# Altium schematic sheet ProPrj_HTXStudio_OneHanded_Keyboard.SchDoc
size 594 x 420 mm
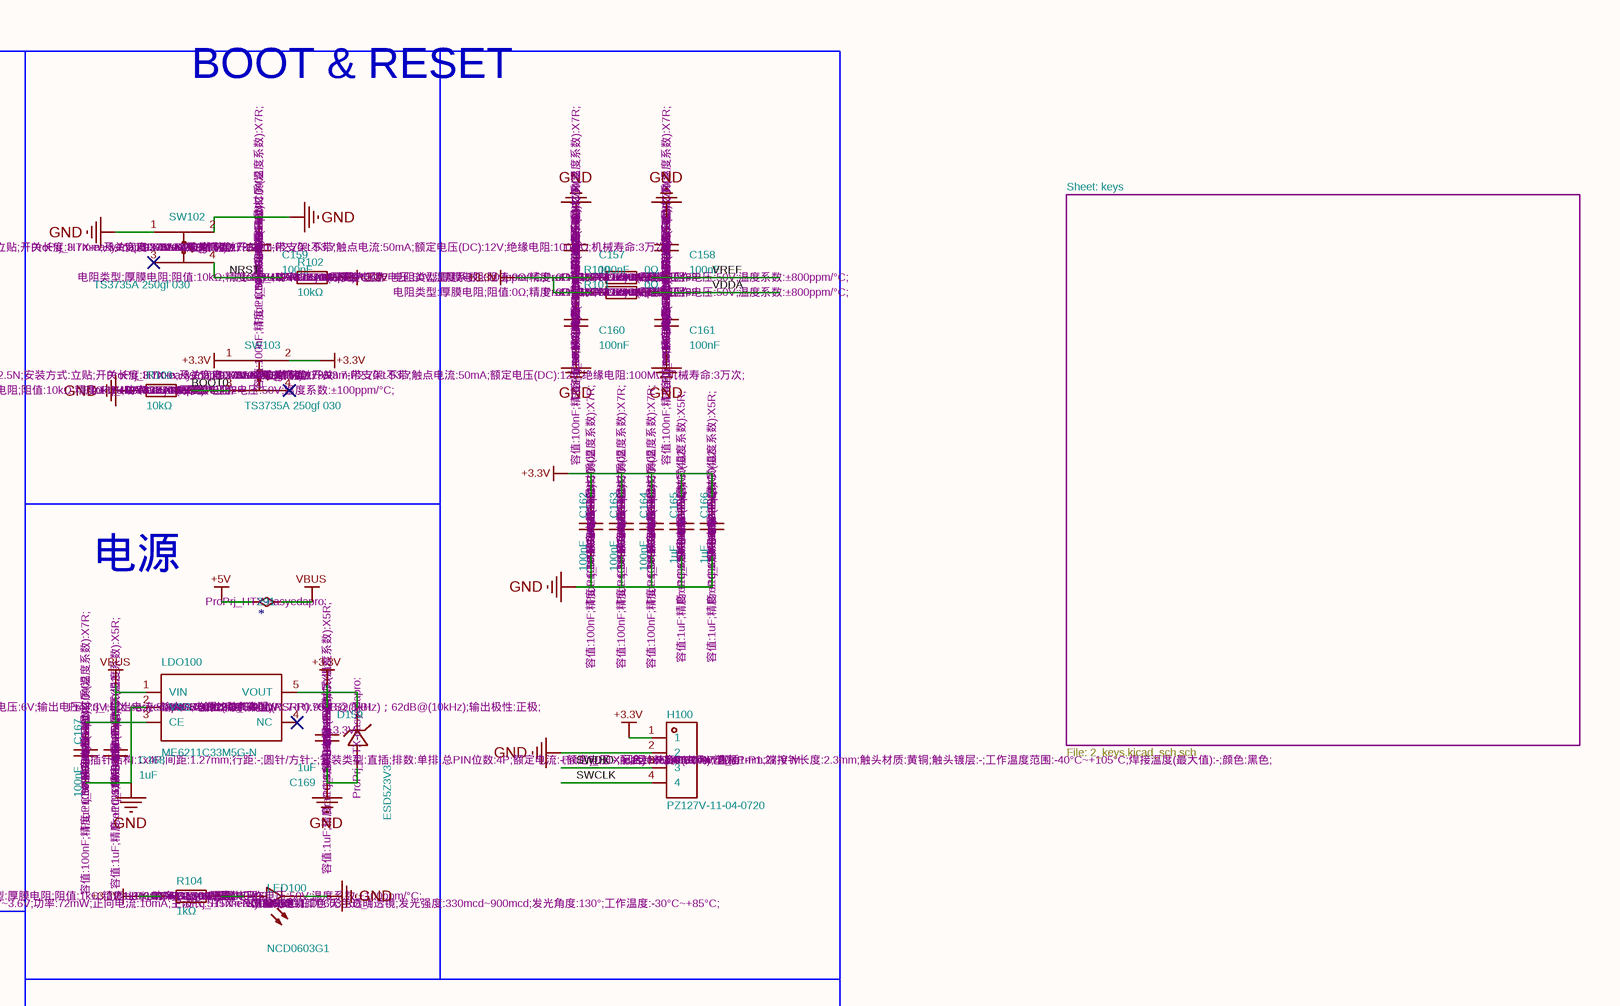
[diagram p0: ProPrj_HTXStudio_OneHanded_Keyboard.SchDoc, top right]
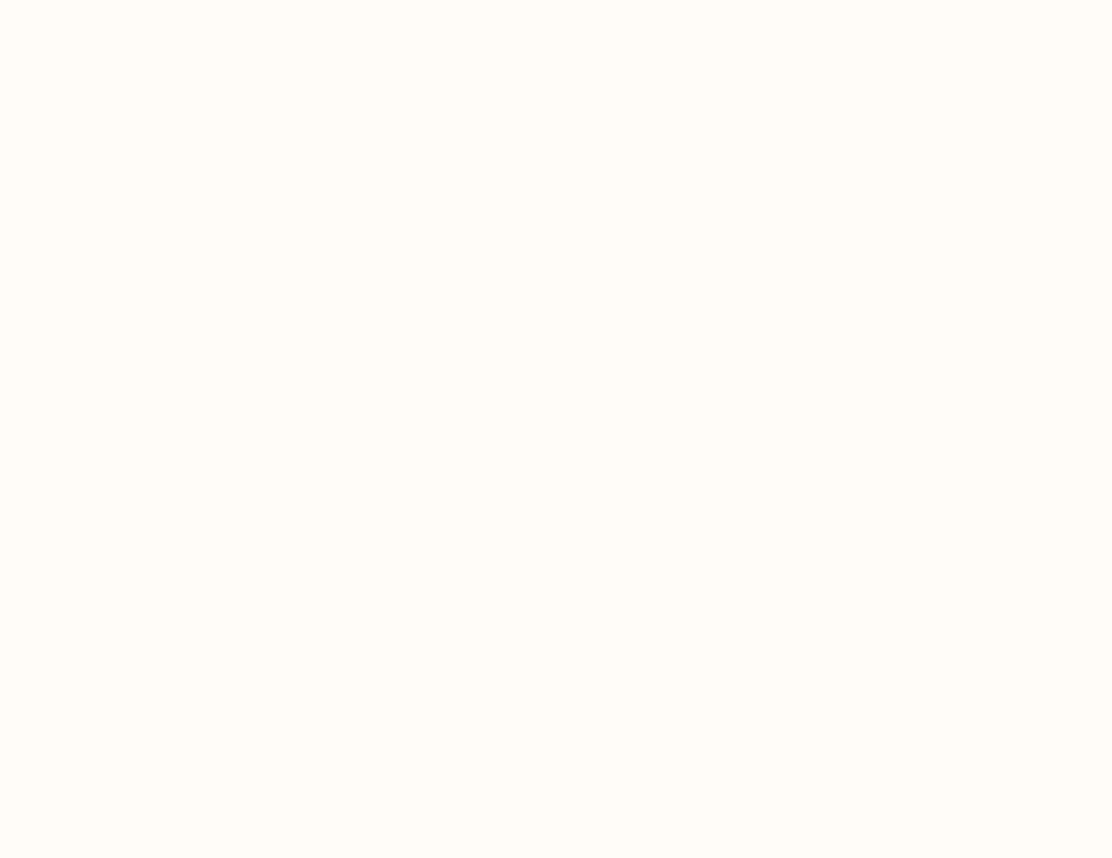
[diagram p1: ProPrj_HTXStudio_OneHanded_Keyboard.SchDoc, bottom left]
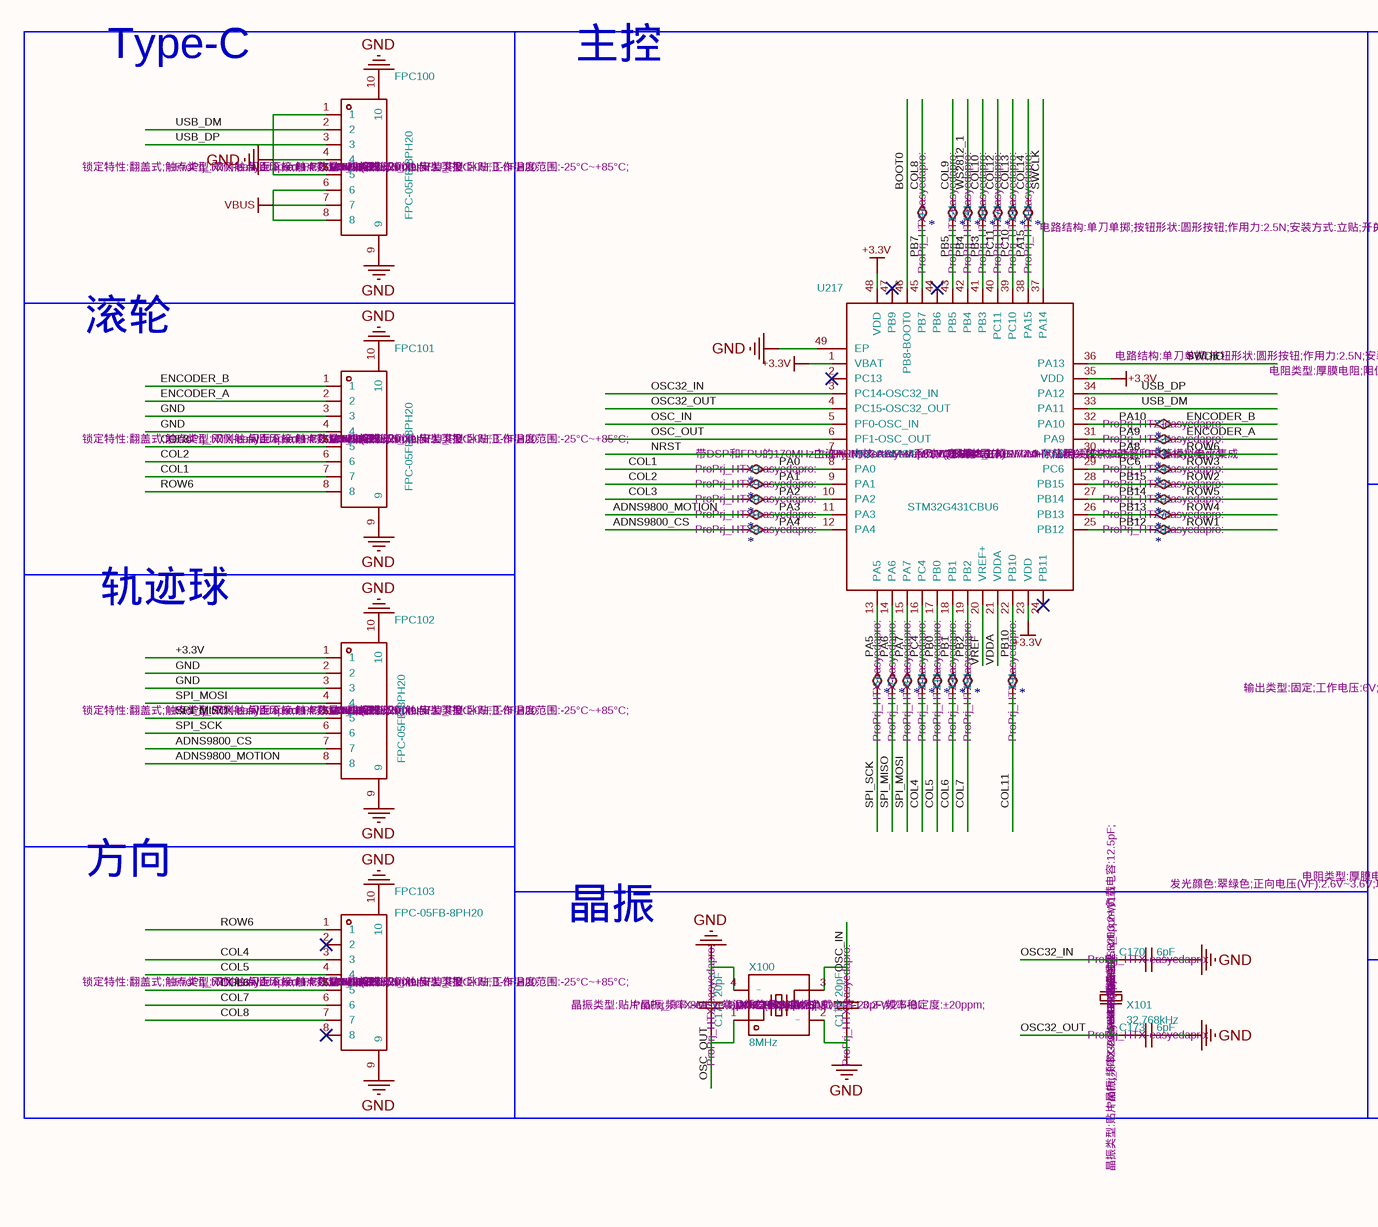
[diagram p2: ProPrj_HTXStudio_OneHanded_Keyboard.SchDoc, bottom middle]
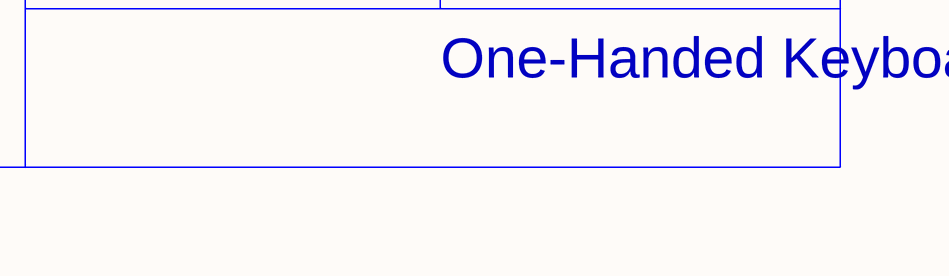
[diagram p3: ProPrj_HTXStudio_OneHanded_Keyboard.SchDoc, bottom right]

## Parts
11  *  Footprint: ProPrj_HTX-easyedapro:
21  *  Footprint: ProPrj_HTX-easyedapro:
31  *  Footprint: ProPrj_HTX-easyedapro:
41  *  Footprint: ProPrj_HTX-easyedapro:
51  *  Footprint: ProPrj_HTX-easyedapro:
61  *  Footprint: ProPrj_HTX-easyedapro:
71  *  Footprint: ProPrj_HTX-easyedapro:
81  *  Footprint: ProPrj_HTX-easyedapro:
91  *  Footprint: ProPrj_HTX-easyedapro:
101  *  Footprint: ProPrj_HTX-easyedapro:
111  *  Footprint: ProPrj_HTX-easyedapro:
121  *  Footprint: ProPrj_HTX-easyedapro:
131  *  Footprint: ProPrj_HTX-easyedapro:
141  *  Footprint: ProPrj_HTX-easyedapro:
151  *  Footprint: ProPrj_HTX-easyedapro:
161  *  Footprint: ProPrj_HTX-easyedapro:
171  *  Footprint: ProPrj_HTX-easyedapro:
181  *  Footprint: ProPrj_HTX-easyedapro:
191  *  Footprint: ProPrj_HTX-easyedapro:
201  *  Footprint: ProPrj_HTX-easyedapro:
211  *  Footprint: ProPrj_HTX-easyedapro:
221  *  Footprint: ProPrj_HTX-easyedapro:
231  *  Footprint: ProPrj_HTX-easyedapro:
241  *  Footprint: ProPrj_HTX-easyedapro:
251  *  Footprint: ProPrj_HTX-easyedapro:
261  *  Footprint: ProPrj_HTX-easyedapro:
271  *  Footprint: ProPrj_HTX-easyedapro:
281  *  Footprint: ProPrj_HTX-easyedapro:
291  *  Footprint: ProPrj_HTX-easyedapro:
C157  Description: 容值:100nF;精度:±10%;额定电压:50V;材质(温度系数):X7R;  Manufacturer: SAMSUNG(三星)  Supplier Part: C307331  Supplier: LCSC  LCSC Part Name: 100nF ±10% 50V  Footprint: ProPrj_HTX-easyedapro:C0402  [C0402]  (hidden comment: 100nF)
C158  Description: 容值:100nF;精度:±10%;额定电压:50V;材质(温度系数):X7R;  Manufacturer: SAMSUNG(三星)  Supplier Part: C307331  Supplier: LCSC  LCSC Part Name: 100nF ±10% 50V  Footprint: ProPrj_HTX-easyedapro:C0402  [C0402]  (hidden comment: 100nF)
C159  Description: 容值:100nF;精度:±10%;额定电压:50V;材质(温度系数):X7R;  Manufacturer: SAMSUNG(三星)  Supplier Part: C307331  Supplier: LCSC  LCSC Part Name: 100nF ±10% 50V  Footprint: ProPrj_HTX-easyedapro:C0402  [C0402]  (hidden comment: 100nF)
C160  Description: 容值:100nF;精度:±10%;额定电压:50V;材质(温度系数):X7R;  Manufacturer: SAMSUNG(三星)  Supplier Part: C307331  Supplier: LCSC  LCSC Part Name: 100nF ±10% 50V  Footprint: ProPrj_HTX-easyedapro:C0402  [C0402]  (hidden comment: 100nF)
C161  Description: 容值:100nF;精度:±10%;额定电压:50V;材质(温度系数):X7R;  Manufacturer: SAMSUNG(三星)  Supplier Part: C307331  Supplier: LCSC  LCSC Part Name: 100nF ±10% 50V  Footprint: ProPrj_HTX-easyedapro:C0402  [C0402]  (hidden comment: 100nF)
C162  Description: 容值:100nF;精度:±10%;额定电压:50V;材质(温度系数):X7R;  Manufacturer: SAMSUNG(三星)  Supplier Part: C307331  Supplier: LCSC  LCSC Part Name: 100nF ±10% 50V  Footprint: ProPrj_HTX-easyedapro:C0402  [C0402]  (hidden comment: 100nF)
C163  Description: 容值:100nF;精度:±10%;额定电压:50V;材质(温度系数):X7R;  Manufacturer: SAMSUNG(三星)  Supplier Part: C307331  Supplier: LCSC  LCSC Part Name: 100nF ±10% 50V  Footprint: ProPrj_HTX-easyedapro:C0402  [C0402]  (hidden comment: 100nF)
C164  Description: 容值:100nF;精度:±10%;额定电压:50V;材质(温度系数):X7R;  Manufacturer: SAMSUNG(三星)  Supplier Part: C307331  Supplier: LCSC  LCSC Part Name: 100nF ±10% 50V  Footprint: ProPrj_HTX-easyedapro:C0402  [C0402]  (hidden comment: 100nF)
C165  Description: 容值:1uF;精度:±10%;额定电压:25V;材质(温度系数):X5R;  Manufacturer: SAMSUNG(三星)  Supplier Part: C52923  Supplier: LCSC  LCSC Part Name: 1uF ±10% 25V  Footprint: ProPrj_HTX-easyedapro:C0402  [C0402]  (hidden comment: 1uF)
C166  Description: 容值:1uF;精度:±10%;额定电压:25V;材质(温度系数):X5R;  Manufacturer: SAMSUNG(三星)  Supplier Part: C52923  Supplier: LCSC  LCSC Part Name: 1uF ±10% 25V  Footprint: ProPrj_HTX-easyedapro:C0402  [C0402]  (hidden comment: 1uF)
C167  Description: 容值:100nF;精度:±10%;额定电压:50V;材质(温度系数):X7R;  Manufacturer: SAMSUNG(三星)  Supplier Part: C307331  Supplier: LCSC  LCSC Part Name: 100nF ±10% 50V  Footprint: ProPrj_HTX-easyedapro:C0402  [C0402]  (hidden comment: 100nF)
C168  Description: 容值:1uF;精度:±10%;额定电压:25V;材质(温度系数):X5R;  Manufacturer: SAMSUNG(三星)  Supplier Part: C52923  Supplier: LCSC  LCSC Part Name: 1uF ±10% 25V  Footprint: ProPrj_HTX-easyedapro:C0402  [C0402]  (hidden comment: 1uF)
C169  Description: 容值:1uF;精度:±10%;额定电压:25V;材质(温度系数):X5R;  Manufacturer: SAMSUNG(三星)  Supplier Part: C52923  Supplier: LCSC  LCSC Part Name: 1uF ±10% 25V  Footprint: ProPrj_HTX-easyedapro:C0402  [C0402]  (hidden comment: 1uF)
C170  Footprint: ProPrj_HTX-easyedapro:  (hidden comment: 6pF)
C171  Footprint: ProPrj_HTX-easyedapro:  (hidden comment: 20pF)
C172  Footprint: ProPrj_HTX-easyedapro:  (hidden comment: 20pF)
C173  Footprint: ProPrj_HTX-easyedapro:  (hidden comment: 6pF)
D159  Description: +3.3V  Footprint: ProPrj_HTX-easyedapro:  (hidden comment: ESD5Z3V3)
FPC100  Description: 锁定特性:翻盖式;触点类型:双侧触点/上下接;触点数量:8P;间距:0.5mm;安装类型:卧贴;工作温度范围:-25°C~+85°C;  Manufacturer: XUNPU(讯普)  Supplier Part: C2856828  Supplier: LCSC  LCSC Part Name: 间距:0.5mm P数:8P 翻盖式 双侧触点/上下接  Footprint: ProPrj_HTX-easyedapro:FPC-SMD_8P-P0.50_XUNPU_FPC-05FB-8PH20  [FPC-SMD_8P-P0.50_XUNPU_FPC-05FB-8PH20]  (hidden comment: FPC-05FB-8PH20)
FPC101  Description: 锁定特性:翻盖式;触点类型:双侧触点/上下接;触点数量:8P;间距:0.5mm;安装类型:卧贴;工作温度范围:-25°C~+85°C;  Manufacturer: XUNPU(讯普)  Supplier Part: C2856828  Supplier: LCSC  LCSC Part Name: 间距:0.5mm P数:8P 翻盖式 双侧触点/上下接  Footprint: ProPrj_HTX-easyedapro:FPC-SMD_8P-P0.50_XUNPU_FPC-05FB-8PH20  [FPC-SMD_8P-P0.50_XUNPU_FPC-05FB-8PH20]  (hidden comment: FPC-05FB-8PH20)
FPC102  Description: 锁定特性:翻盖式;触点类型:双侧触点/上下接;触点数量:8P;间距:0.5mm;安装类型:卧贴;工作温度范围:-25°C~+85°C;  Manufacturer: XUNPU(讯普)  Supplier Part: C2856828  Supplier: LCSC  LCSC Part Name: 间距:0.5mm P数:8P 翻盖式 双侧触点/上下接  Footprint: ProPrj_HTX-easyedapro:FPC-SMD_8P-P0.50_XUNPU_FPC-05FB-8PH20  [FPC-SMD_8P-P0.50_XUNPU_FPC-05FB-8PH20]  (hidden comment: FPC-05FB-8PH20)
FPC103  Description: 锁定特性:翻盖式;触点类型:双侧触点/上下接;触点数量:8P;间距:0.5mm;安装类型:卧贴;工作温度范围:-25°C~+85°C;  Manufacturer: XUNPU(讯普)  Supplier Part: C2856828  Supplier: LCSC  LCSC Part Name: 间距:0.5mm P数:8P 翻盖式 双侧触点/上下接  Footprint: ProPrj_HTX-easyedapro:FPC-SMD_8P-P0.50_XUNPU_FPC-05FB-8PH20  [FPC-SMD_8P-P0.50_XUNPU_FPC-05FB-8PH20]  (hidden comment: FPC-05FB-8PH20)
H100  Description: 插针结构:1x4P;间距:1.27mm;行距:-;圆针/方针:-;安装类型:直插;排数:单排;总PIN位数:4P;额定电流:-;额定电压:-;配合针长度:3.9mm;塑高:1mm;端接针长度:2.3mm;触头材质:黄铜;触头镀层:-;工作温度范围:-40°C~+105°C;焊接温度(最大值):-;颜色:黑色;  Manufacturer: XFCN(兴飞)  Supplier Part: C541879  Supplier: LCSC  LCSC Part Name: 间距:1.27mm 1x4P 直插  Footprint: ProPrj_HTX-easyedapro:HDR-TH_4P-P1.27-V-M  [HDR-TH_4P-P1.27-V-M]  (hidden comment: PZ127V-11-04-0720)
LDO100  Description: 输出类型:固定;工作电压:6V;输出电压:3.3V;输出电流:500mA;电源纹波抑制比(PSRR):70dB@(1kHz)；62dB@(10kHz);输出极性:正极;  Manufacturer: MICRONE(南京微盟)  Supplier Part: C82942  Supplier: LCSC  LCSC Part Name: 输入6V 输出3.3V 500mA  Footprint: ProPrj_HTX-easyedapro:SOT-23-5_L3.0-W1.7-P0.95-LS2.8-BL  [SOT-23-5_L3.0-W1.7-P0.95-LS2.8-BL]  (hidden comment: ME6211C33M5G-N)
LED100  Description: 发光颜色:翠绿色;正向电压(VF):2.6V~3.6V;功率:72mW;正向电流:10mA;主波长:515nm~530nm;透镜颜色:无色透明透镜;发光强度:330mcd~900mcd;发光角度:130°;工作温度:-30°C~+85°C;  Manufacturer: 国星光电  Supplier Part: C84267  Supplier: LCSC  Footprint: ProPrj_HTX-easyedapro:LED0603-RD_1  [LED0603-RD_1]  (hidden comment: NCD0603G1)
R100  Description: 电阻类型:厚膜电阻;阻值:0Ω;精度:±1%;功率:62.5mW;最大工作电压:50V;温度系数:±800ppm/°C;  Manufacturer: UNI-ROYAL(厚声)  Supplier Part: C17168  Supplier: LCSC  LCSC Part Name: 0Ω ±1% 62.5mW 厚膜电阻  Footprint: ProPrj_HTX-easyedapro:R0402  [R0402]  (hidden comment: 0Ω)
R101  Description: 电阻类型:厚膜电阻;阻值:0Ω;精度:±1%;功率:62.5mW;最大工作电压:50V;温度系数:±800ppm/°C;  Manufacturer: UNI-ROYAL(厚声)  Supplier Part: C17168  Supplier: LCSC  LCSC Part Name: 0Ω ±1% 62.5mW 厚膜电阻  Footprint: ProPrj_HTX-easyedapro:R0402  [R0402]  (hidden comment: 0Ω)
R102  Description: 电阻类型:厚膜电阻;阻值:10kΩ;精度:±1%;功率:62.5mW;最大工作电压:50V;温度系数:±100ppm/°C;  Manufacturer: UNI-ROYAL(厚声)  Supplier Part: C25744  Supplier: LCSC  LCSC Part Name: 10kΩ ±1% 62.5mW 厚膜电阻  Footprint: ProPrj_HTX-easyedapro:R0402  [R0402]  (hidden comment: 10kΩ)
R103  Description: 电阻类型:厚膜电阻;阻值:10kΩ;精度:±1%;功率:62.5mW;最大工作电压:50V;温度系数:±100ppm/°C;  Manufacturer: UNI-ROYAL(厚声)  Supplier Part: C25744  Supplier: LCSC  LCSC Part Name: 10kΩ ±1% 62.5mW 厚膜电阻  Footprint: ProPrj_HTX-easyedapro:R0402  [R0402]  (hidden comment: 10kΩ)
R104  Description: 电阻类型:厚膜电阻;阻值:1kΩ;精度:±1%;功率:62.5mW;最大工作电压:50V;温度系数:±100ppm/°C;  Manufacturer: UNI-ROYAL(厚声)  Supplier Part: C11702  Supplier: LCSC  LCSC Part Name: 1kΩ ±1% 62.5mW 厚膜电阻  Footprint: ProPrj_HTX-easyedapro:R0402  [R0402]  (hidden comment: 1kΩ)
SW102  Description: 电路结构:单刀单掷;按钮形状:圆形按钮;作用力:2.5N;安装方式:立贴;开关长度:3.7mm;开关宽度:3.7mm;开关高度:0.35mm;带支架:不带;触点电流:50mA;额定电压(DC):12V;绝缘电阻:100MΩ;机械寿命:3万次;  Manufacturer: SHOU HAN(首韩)  Supplier Part: C2906282  Supplier: LCSC  LCSC Part Name: 3.7*3.7*0.35mm 立贴 轻触开关  Footprint: ProPrj_HTX-easyedapro:SW-SMD_4P-L3.7-W3.7-P2.70-LS3.7  [SW-SMD_4P-L3.7-W3.7-P2.70-LS3.7]  (hidden comment: TS3735A 250gf 030)
SW103  Description: 电路结构:单刀单掷;按钮形状:圆形按钮;作用力:2.5N;安装方式:立贴;开关长度:3.7mm;开关宽度:3.7mm;开关高度:0.35mm;带支架:不带;触点电流:50mA;额定电压(DC):12V;绝缘电阻:100MΩ;机械寿命:3万次;  Manufacturer: SHOU HAN(首韩)  Supplier Part: C2906282  Supplier: LCSC  LCSC Part Name: 3.7*3.7*0.35mm 立贴 轻触开关  Footprint: ProPrj_HTX-easyedapro:SW-SMD_4P-L3.7-W3.7-P2.70-LS3.7  [SW-SMD_4P-L3.7-W3.7-P2.70-LS3.7]  (hidden comment: TS3735A 250gf 030)
U217  Description: CPU内核:ARM-M系列;CPU最大主频:170MHz;应用领域:-;  Manufacturer: ST(意法半导体)  Supplier Part: C529356  Supplier: LCSC  LCSC Part Name: 带DSP和FPU的170MHz主流ARM Cortex-M4 MCU，具有128 KB Flash存储器、数学加速器和中等模拟电平集成  Footprint: ProPrj_HTX-easyedapro:VQFN-48_L7.0-W7.0-P0.50-BL-EP5.5  [VQFN-48_L7.0-W7.0-P0.50-BL-EP5.5]  (hidden comment: STM32G431CBU6)
X100  Description: 晶振类型:贴片晶振;频率:8MHz;常温频差:±10ppm;负载电容:20pF;频率稳定度:±20ppm;  Manufacturer: YXC(扬兴晶振)  Supplier Part: C2682774  Supplier: LCSC  LCSC Part Name: 8MHz ±10ppm 20pF  Footprint: ProPrj_HTX-easyedapro:CRYSTAL-SMD_4P-L3.2-W2.5-BL  [CRYSTAL-SMD_4P-L3.2-W2.5-BL]  (hidden comment: 8MHz)
X101  Description: 晶振类型:贴片晶振;频率:32.768kHz;常温频差:±20ppm;负载电容:12.5pF;  Manufacturer Part: Q13FC13500004  Manufacturer: EPSON(爱普生)  Supplier Part: C32346  Supplier: LCSC  LCSC Part Name: 32.768kHz ±20ppm 12.5pF  Footprint: ProPrj_HTX-easyedapro:FC-135R_L3.2-W1.5  [FC-135R_L3.2-W1.5]  (hidden comment: 32.768kHz)

## Blocks framed on the sheet
Type-C: FPC100
主控: 11 21 31 41 51 61 71 81 91 101 111 121 131 141 151 161 171 181 191 201 211 221 231 241 251 261 271 281 U217
BOOT & RESET: C159 R102 R103 SW102 SW103
滚轮: FPC101
电源: 291 C167-C169 D159 LDO100 LED100 R104
轨迹球: FPC102
方向: FPC103
晶振: C170-C173 X100 X101

## Sub-sheets
keys = 2_keys.SchDoc: no entries

## Nets
+3.3V: C157.1 C160.2 C162.2 C163.2 C164.2 C165.2 C166.2 C169.2 FPC102.1 H100.1 R100.1 R101.1 R102.2 R104.1 SW103.1 SW103.2 U217.1(VBAT) U217.23(VDD) U217.35(VDD) U217.48(VDD)
+5V: 291.1(Pin1)
GND: C157.2 C158.2 C159.2 C160.1 C161.1 C162.1 C163.1 C164.1 C165.1 C166.1 C167.1 C168.1 C169.1 C170.2 C171.2 C172.1 C173.2 D159.2(A) FPC100.1 FPC100.4 FPC100.5 FPC100.9 FPC100.10 FPC101.3 FPC101.4 FPC101.9 FPC101.10 FPC102.2 FPC102.3 FPC102.9 FPC102.10 FPC103.9 FPC103.10 H100.2 LDO100.2(VSS) LED100.1(K) R103.1 SW102.1 SW102.2 U217.49(EP) X100.2(GND) X100.4(GND)
VBUS: 291.2(Pin1) C167.2 C168.2 FPC100.6 FPC100.7 FPC100.8 LDO100.1(VIN) LDO100.3(CE)
ADNS9800_CS: 51.1(Pin1) FPC102.7
ADNS9800_MOTION: 41.1(Pin1) FPC102.8
BOOT0: R103.2 SW103.3 U217.46(PB8-BOOT0)
COL1: 11.1(Pin1) FPC101.7
COL2: 21.1(Pin1) FPC101.6
COL3: 31.1(Pin1) FPC101.5
COL4: 101.1(Pin1) FPC103.3
COL5: 111.1(Pin1) FPC103.4
COL6: 131.1(Pin1) FPC103.5
COL7: 151.1(Pin1) FPC103.6
COL8: 91.2(Pin1) FPC103.7
COL9: 121.2(Pin1)
COL10: 161.2(Pin1)
COL11: 191.1(Pin1)
COL12: 171.2(Pin1)
COL13: 181.2(Pin1)
COL14: 201.2(Pin1)
ENCODER_A: 221.2(Pin1) FPC101.2
ENCODER_B: 211.2(Pin1) FPC101.1
NRST: C159.1 R102.1 SW102.4 U217.7(PG10-NRST)
OSC32_IN: C170.1 U217.3(PC14-OSC32_IN) X101.2
OSC32_OUT: C173.1 U217.4(PC15-OSC32_OUT) X101.1
OSC_IN: C172.2 U217.5(PF0-OSC_IN) X100.3
OSC_OUT: C171.1 U217.6(PF1-OSC_OUT) X100.1
PA0: 11.2(Pin1) U217.8(PA0)
PA1: 21.2(Pin1) U217.9(PA1)
PA2: 31.2(Pin1) U217.10(PA2)
PA3: 41.2(Pin1) U217.11(PA3)
PA4: 51.2(Pin1) U217.12(PA4)
PA5: 61.2(Pin1) U217.13(PA5)
PA6: 71.2(Pin1) U217.14(PA6)
PA7: 81.2(Pin1) U217.15(PA7)
PA8: 231.1(Pin1) U217.30(PA8)
PA9: 221.1(Pin1) U217.31(PA9)
PA10: 211.1(Pin1) U217.32(PA10)
PA15: 201.1(Pin1) U217.38(PA15)
PB0: 111.2(Pin1) U217.17(PB0)
PB1: 131.2(Pin1) U217.18(PB1)
PB2: 151.2(Pin1) U217.19(PB2)
PB3: 161.1(Pin1) U217.41(PB3)
PB4: 141.1(Pin1) U217.42(PB4)
PB5: 121.1(Pin1) U217.43(PB5)
PB7: 91.1(Pin1) U217.45(PB7)
PB10: 191.2(Pin1) U217.22(PB10)
PB12: 281.1(Pin1) U217.25(PB12)
PB13: 271.1(Pin1) U217.26(PB13)
PB14: 261.1(Pin1) U217.27(PB14)
PB15: 251.1(Pin1) U217.28(PB15)
PC4: 101.2(Pin1) U217.16(PC4)
PC6: 241.1(Pin1) U217.29(PC6)
PC10: 181.1(Pin1) U217.39(PC10)
PC11: 171.1(Pin1) U217.40(PC11)
ROW1: 281.2(Pin1)
ROW2: 251.2(Pin1)
ROW3: 241.2(Pin1)
ROW4: 271.2(Pin1)
ROW5: 261.2(Pin1)
ROW6: 231.2(Pin1) FPC101.8 FPC103.1
SPI_MISO: 71.1(Pin1) FPC102.5
SPI_MOSI: 81.1(Pin1) FPC102.4
SPI_SCK: 61.1(Pin1) FPC102.6
SWCLK: H100.4 U217.37(PA14)
SWDIO: H100.3 U217.36(PA13)
USB_DM: FPC100.2 U217.33(PA11)
USB_DP: FPC100.3 U217.34(PA12)
VDDA: C161.2 R101.2 U217.21(VDDA)
VREF: C158.1 R100.2 U217.20(VREF+)
WS2812_1: 141.2(Pin1)
NetD159_1: D159.1(C) LDO100.5(VOUT)
NetLED100_2: LED100.2(A) R104.2

Not connected (* = marked no-connect by the designer): FPC103 2* 8*; LDO100 4(NC)*; SW102 3*; SW103 4*; U217 2(PC13)* 24(PB11)* 44(PB6)* 47(PB9)*

## Notes on the sheet
- Sheet: keys
- File: 2_keys.kicad_sch.sch
- One-Handed Keyboard_MR
- 1
- 2
- 3
- 4
- 5
- 6
- 7
- 8
- 9
- 10
- 11
- A
- B
- C
- D
- E
- F
- G
- H
- Title:
- File: ProPrj_HTXStudio_OneHanded_Keyboard.kicad_sch
- Sheet: /
- KiCad E.D.A.  kicad (5.1.4)-1
- Size: A2
- Date:
- Rev:
- Id: 1/1

## Library data of the parts
11 21 31 41 51 61 71 81 91 101 111 121 131 141 151 161 171 181 191 201 211 221 231 241 251 261 271 281 291 = Short-Symbol
C157-C164 C167 = CL05B104KB54PNC: Manufacturer Part: CL05B104KB54PNC; Value: 100nF
C165 C166 C168 C169 = CL05A105KA5NQNC: Manufacturer Part: CL05A105KA5NQNC; Value: 1uF
C170 C173 = GJM1555C1H6R0WB01D: Value: 6pF
C171 C172 = GRM1555C1H200JA01D: Value: 20pF
D159 = esd5z3v3_c2841409: Value: ESD5Z3V3
LED100 = FC-D1608UGK-520D10: Manufacturer Part: NCD0603G1; LCSC Part Name: NCD0603G1; Value: NCD0603G1
R100 R101 = 0402WGF0000TCE: Manufacturer Part: 0402WGF0000TCE; Value: 0Ω
R102 R103 = 0402WGF1002TCE: Manufacturer Part: 0402WGF1002TCE; Value: 10kΩ
R104 = 0402WGF1001TCE: Manufacturer Part: 0402WGF1001TCE; Value: 1kΩ
X100 = X32258MSB4SI: Manufacturer Part: X32258MSB4SI; Value: 8MHz
X101 = Q13FC1350000400: Value: 32.768kHz
FPC100-FPC103 = FPC-05FB-8PH20: Manufacturer Part: FPC-05FB-8PH20; Value: FPC-05FB-8PH20
H100 = PZ127V-11-04-0720: Manufacturer Part: PZ127V-11-04-0720; Value: PZ127V-11-04-0720
LDO100 = ME6211C33M5G-N: Manufacturer Part: ME6211C33M5G-N; Value: ME6211C33M5G-N
SW102 SW103 = TS3735A 250GF 030: Manufacturer Part: TS3735A 250gf 030; Value: TS3735A 250gf 030
U217 = STM32G431CBU6: Manufacturer Part: STM32G431CBU6; Value: STM32G431CBU6